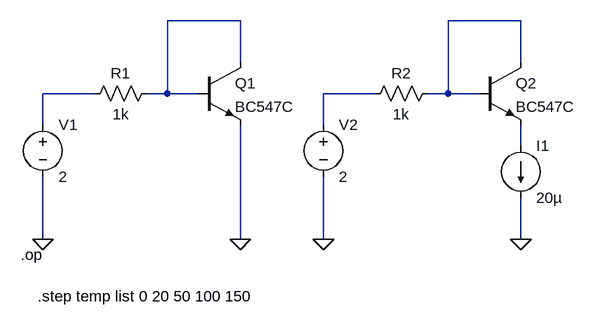
[diagram p0: schematic temp_test.asc]
temp_test.asc, the LTspice schematic file:
Version 4
SHEET 1 880 680
WIRE 208 0 96 0
WIRE 640 0 528 0
WIRE 208 64 208 0
WIRE 640 64 640 0
WIRE -16 112 -96 112
WIRE 96 112 96 0
WIRE 96 112 64 112
WIRE 144 112 96 112
WIRE 416 112 336 112
WIRE 528 112 528 0
WIRE 528 112 496 112
WIRE 576 112 528 112
WIRE -96 160 -96 112
WIRE 336 160 336 112
WIRE 640 192 640 160
WIRE -96 336 -96 240
WIRE 208 336 208 160
WIRE 336 336 336 240
WIRE 640 336 640 272
FLAG 208 336 0
FLAG -96 336 0
FLAG 640 336 0
FLAG 336 336 0
SYMBOL npn 144 64 R0
SYMATTR InstName Q1
SYMATTR Value BC547C
SYMBOL res 80 96 R90
WINDOW 0 0 56 VBottom 2
WINDOW 3 32 56 VTop 2
SYMATTR InstName R1
SYMATTR Value 1k
SYMBOL voltage -96 144 R0
WINDOW 123 0 0 Left 2
WINDOW 39 0 0 Left 2
SYMATTR InstName V1
SYMATTR Value 2
SYMBOL npn 576 64 R0
SYMATTR InstName Q2
SYMATTR Value BC547C
SYMBOL res 512 96 R90
WINDOW 0 0 56 VBottom 2
WINDOW 3 32 56 VTop 2
SYMATTR InstName R2
SYMATTR Value 1k
SYMBOL voltage 336 144 R0
WINDOW 123 0 0 Left 2
WINDOW 39 0 0 Left 2
SYMATTR InstName V2
SYMATTR Value 2
SYMBOL current 640 192 R0
WINDOW 123 0 0 Left 2
WINDOW 39 0 0 Left 2
SYMATTR InstName I1
SYMATTR Value 20µ
TEXT -130 360 Left 2 !.op
TEXT -104 424 Left 2 !.step temp list 0 20 50 100 150

The netlist it stands for:
* temp_test.asc
Q1 N001 N001 0 0 BC547C
R1 N001 N003 1k
V1 N003 0 2
Q2 N002 N002 N005 0 BC547C
R2 N002 N004 1k
V2 N004 0 2
I1 N005 0 20µ
.model NPN NPN
.model PNP PNP
.lib standard.bjt
.op
.step temp list 0 20 50 100 150
.backanno
.end